# EAGLE design XBee_Explorer (EAGLE 9.6.2)
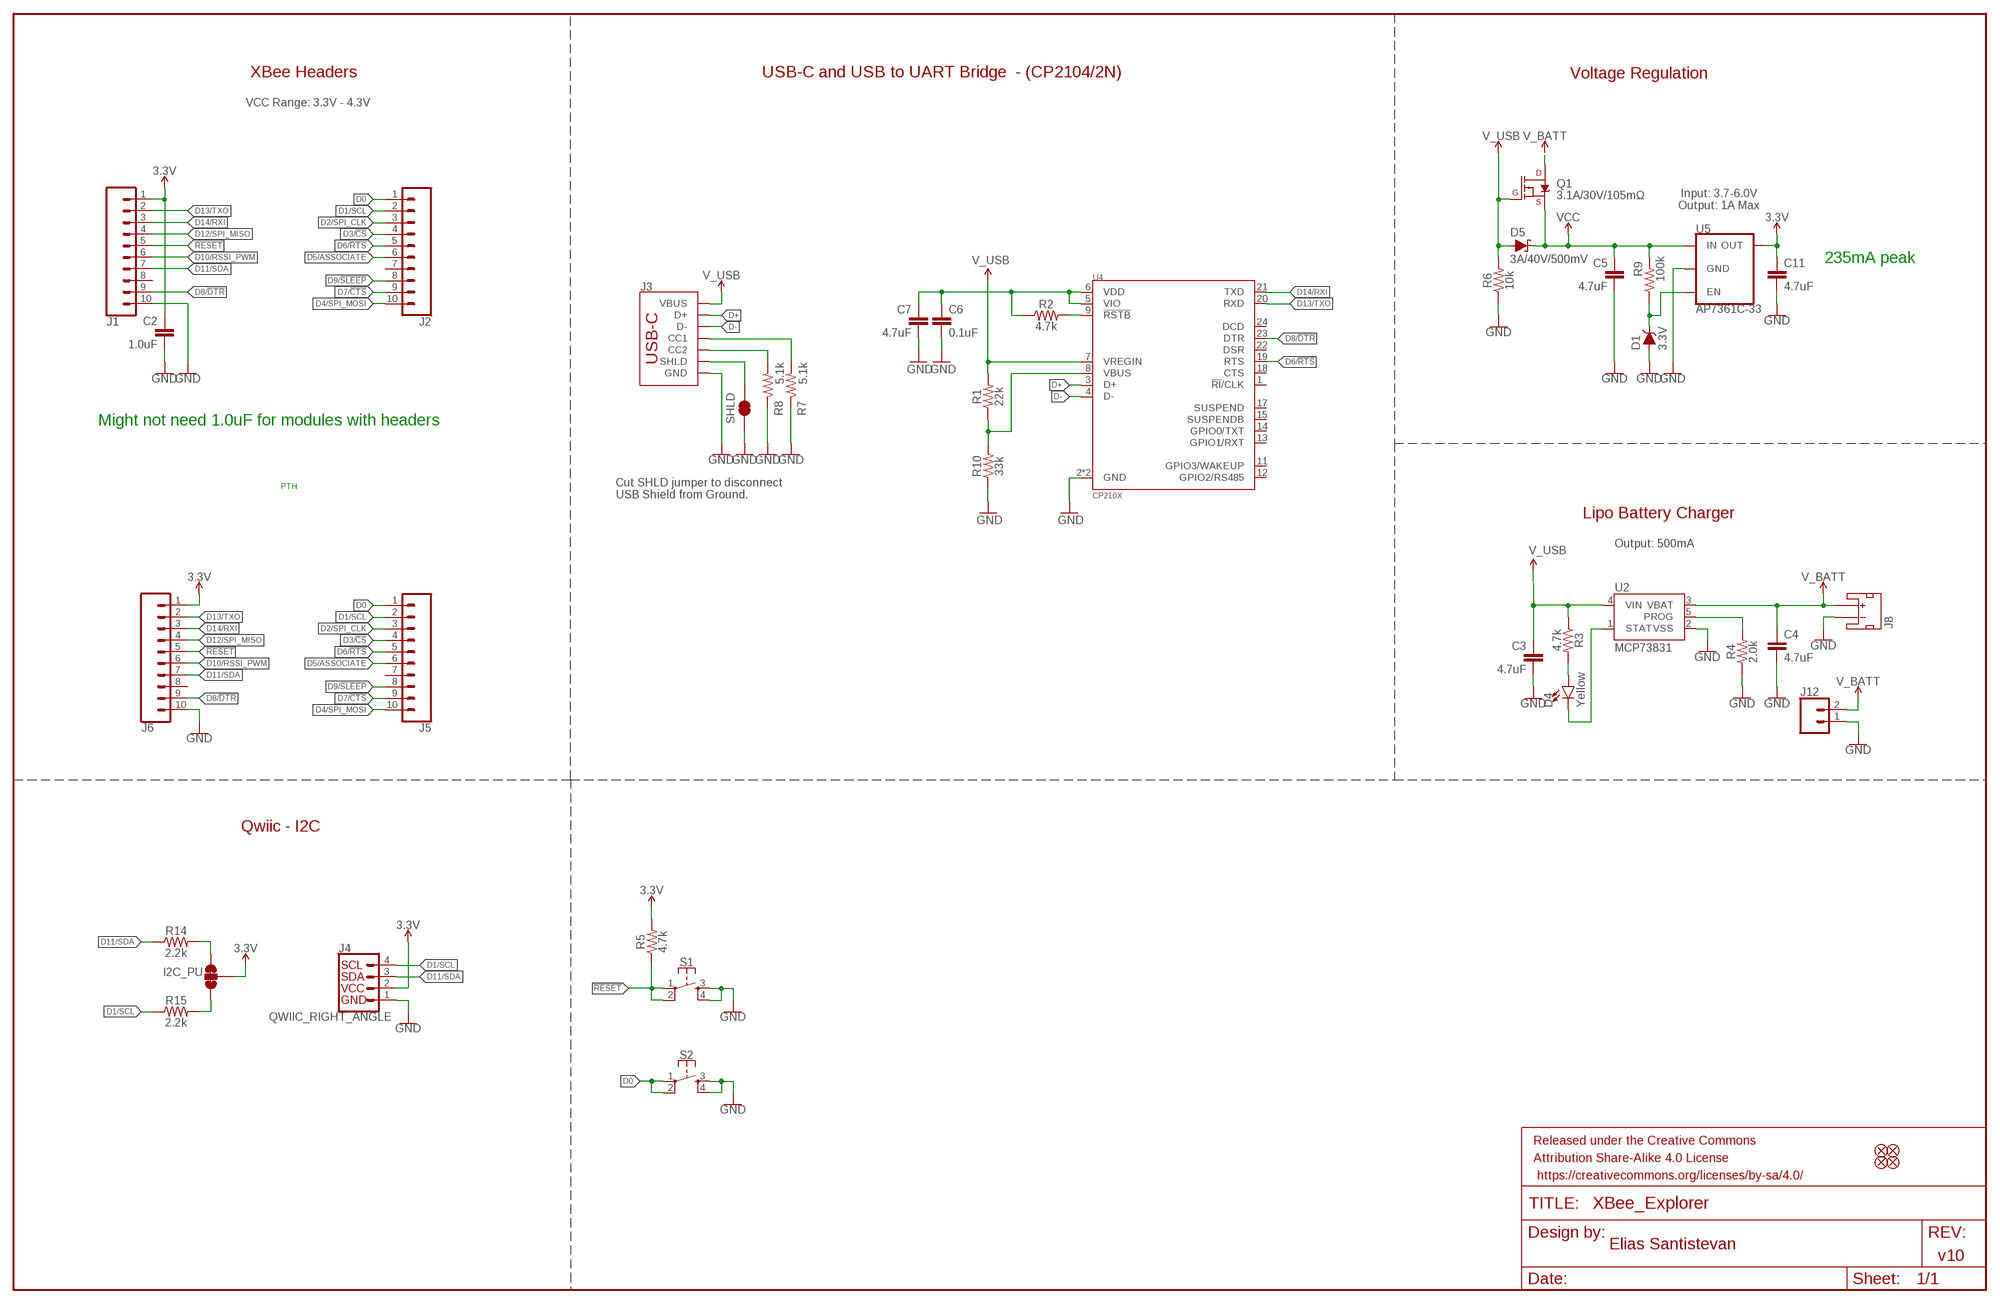
[diagram p0: schematic, sheet 1]

## Parts
C2  1.0uF  1.0UF-0603-16V-10%  [0603]
C3  4.7uF  4.7UF-0603-6.3V-(10%)  [0603]
C4  4.7uF  4.7UF-0603-35V-(20%)  [0603]
C5  4.7uF  4.7UF-0603-6.3V-(10%)  [0603]
C6  0.1uF  0.1UF-0603-25V-(+80/-20%)  [0603]
C7  4.7uF  4.7UF-0603-6.3V-(10%)  [0603]
C11  4.7uF  4.7UF-0603-6.3V-(10%)  [0603]
D1  3.3V  DIODE-ZENER-MM3Z3V3T1G  [SOD-323]
D4  Yellow  LED-YELLOW0603  [LED-0603]
D5  3A/40V/500mV  DIODE-SCHOTTKY-B340A  [SMA-DIODE]
FD1  FIDUCIAL1X2  [FIDUCIAL-1X2]
FD2  FIDUCIAL1X2  [FIDUCIAL-1X2]
FD3  FIDUCIAL1X2  [FIDUCIAL-1X2]
FD4  FIDUCIAL1X2  [FIDUCIAL-1X2]
FRAME1  FRAME-LEDGER  [CREATIVE_COMMONS]
I2C_PU  JUMPER-SMT_3_2-NC_TRACE_SILK  [SMT-JUMPER_3_2-NC_TRACE_SILK]
J1  CONN_10NO_SILK_PTH_FEMALE  [1X10_NO_SILK]
J2  CONN_10NO_SILK_PTH_FEMALE  [1X10_NO_SILK]
J3  USB_C_2-LAYER_PADS  [USB-C-16P-2LAYER-PADS]
J4  QWIIC_RIGHT_ANGLE  QWIIC_CONNECTORJS-1MM  [JST04_1MM_RA]
J5  CONN_10NO_SILK_PTH_FEMALE  [1X10_NO_SILK]
J6  CONN_10NO_SILK_PTH_FEMALE  [1X10_NO_SILK]
J8  JST_2MM_MALE  [JST-2-SMD]
J12  CONN_021X02_NO_SILK  [1X02_NO_SILK]
Q1  3.1A/30V/105mΩ  MOSFET_PCH-DMG2307L  [SOT23-3]
R1  22k  22KOHM-0603-1/10W-1%  [0603]
R2  4.7k  4.7KOHM-0603-1/10W-1%  [0603]
R3  4.7k  4.7KOHM-0603-1/10W-1%  [0603]
R4  2.0k  2.0KOHM-0603-1/10W-5%  [0603]
R5  4.7k  4.7KOHM-0603-1/10W-1%  [0603]
R6  10k  10KOHM-0603-1/10W-1%  [0603]
R7  5.1k  5.1KOHM5.1KOHM-0603-1/10W-1%  [0603]
R8  5.1k  5.1KOHM5.1KOHM-0603-1/10W-1%  [0603]
R9  100k  100KOHM-0603-1/10W-1%  [0603]
R10  33k  33KOHM-0603-1/10W-1%  [0603]
R14  2.2k  2.2KOHM-0603-1/10W-1%  [0603]
R15  2.2k  2.2KOHM-0603-1/10W-1%  [0603]
S1  MOMENTARY-SWITCH-SPST-2-SMD-5.2MM-TALL  [TACTILE_SWITCH_SMD_5.2MM]
S2  MOMENTARY-SWITCH-SPST-2-SMD-5.2MM-TALL  [TACTILE_SWITCH_SMD_5.2MM]
SHLD  JUMPER-SMT_2_NC_TRACE_SILK  [SMT-JUMPER_2_NC_TRACE_SILK]
U2  MCP73831  [SOT23-5]
U4  CP210X  CP2102N  [QFN24]
U5  AP7361C-33  AP7361C-33FGEUDFN-8  [UDFN-8]

## Nets
3.3V: C2.1 C11.1 I2C_PU.2 J1.1 J4.2 J6.1 R5.2 U5.1(OUT)
3.3V_EN_VE: D1.C R9.1 U5.5(EN)
!RESET!: J1.5 J6.5 R5.1 S1.1 S1.2
D0: J2.1 J5.1 S2.1 S2.2
D1/SCL: J2.2 J4.4 J5.2 R15.1
D2/SPI_CLK: J2.3 J5.3
D3/!CS!: J2.4 J5.4
D4/SPI_MOSI: J2.10 J5.10
D5/ASSOCIATE: J2.6 J5.6
D6/!RTS!: J2.5 J5.5 U4.19(RTS)
D7/!CTS!: J2.9 J5.9
D8/!DTR!: J1.9 J6.9 U4.23(DTR)
D9/!SLEEP!: J2.8 J5.8
D10/RSSI_PWM: J1.6 J6.6
D11/SDA: J1.7 J4.3 J6.7 R14.1
D12/SPI_MISO: J1.4 J6.4
D13/TXO: J1.2 J6.2 U4.20(RXD)
D14/RXI: J1.3 J6.3 U4.21(TXD)
D+: J3.A6(D+) J3.B6(D+) U4.3(D+)
D-: J3.A7(D-) J3.B7(D-) U4.4(D-)
GND: C2.2 C3.2 C4.2 C5.2 C6.2 C7.2 C11.2 D1.A J1.10 J3.GND J3.GND2(GND) J4.1 J6.10 J8.1(-) J12.1 R4.1 R6.1 R7.1 R8.1 R10.1 S1.3 S1.4 S2.3 S2.4 SHLD.1 U2.2(VSS) U4.2(GND) U4.PAD(GND) U5.4(GND) U5.EP(GND)
N$1: R4.2 U2.5(PROG)
N$2: R1.1 R10.2 U4.8(VBUS)
N$3: C6.1 C7.1 R2.1 U4.5(VIO) U4.6(VDD)
N$4: J3.B5(CC2) R8.2
N$5: J3.A5(CC1) R7.2
N$6: R2.2 U4.9(!RSTB)
N$8: D4.C U2.1(STAT)
N$9: D4.A R3.2
N$10: C3.1 R3.1 U2.4(VIN)
N$11: I2C_PU.3 R14.2
N$13: I2C_PU.1 R15.2
SHLD: J3.SHLD1(SHLD) J3.SHLD2(SHLD) J3.SHLD3(SHLD) J3.SHLD4(SHLD) SHLD.2
V_BATT [POWER]: C4.1 J8.2(+) J12.2 Q1.3(D) U2.3(VBAT)
V_USB: D5.A J3.VBUS1(VBUS) J3.VBUS2(VBUS) Q1.1(G) R1.2 R6.2 U4.7(VREGIN)
VCC: C5.1 D5.C Q1.2(S) R9.2 U5.8(IN)
Unconnected: J1.8 J2.7 J5.7 J6.8 J8.NC1(PAD1) J8.NC2(PAD2) U4.1(!RI!/CLK) U4.11(GPIO3/WAKEUP) U4.12(GPIO2/RS485) U4.13(GPIO1/RXT) U4.14(GPIO0/TXT) U4.15(SUSPENDB) U4.17(SUSPEND) U4.18(CTS) U4.22(DSR) U4.24(DCD)

## Notes on the sheet
- XBee Headers | USB-C and USB to UART Bridge  - (CP2104/2N) | Voltage Regulation
- VCC Range: 3.3V - 4.3V
- Input: 3.7-6.0V
  Output: 1A Max
- 235mA peak
- Might not need 1.0uF for modules with headers
- PTH
- Cut SHLD jumper to disconnect
  USB Shield from Ground.
- Lipo Battery Charger
- Output: 500mA
- Qwiic - I2C
- Elias Santistevan
- v10

## Library data of the parts
C2 = SparkFun-Capacitors:1.0UF: 1µF ceramic capacitors A capacitor is a passive two-terminal electrical component used to store electrical energy temporarily in an electric field.; PROD_ID: CAP-00868
C3 C5 C7 C11 = SparkFun-Capacitors:4.7UF: 4.7µF ceramic capacitors A capacitor is a passive two-terminal electrical component used to store electrical energy temporarily in an electric field.; PROD_ID: CAP-08280
C4 = SparkFun-Capacitors:4.7UF: 4.7µF ceramic capacitors A capacitor is a passive two-terminal electrical component used to store electrical energy temporarily in an electric field.; PROD_ID: CAP-14106
C6 = SparkFun-Capacitors:0.1UF: 0.1µF ceramic capacitors A capacitor is a passive two-terminal electrical component used to store electrical energy temporarily in an electric field.; PROD_ID: CAP-00810
D1 = SparkFun-DiscreteSemi:DIODE-ZENER: Zener Diode A Zener diode allows current to flow from its anode to its cathode like a normal semiconductor diode, but it also permits current to flow in the reverse direction when its "Zener voltage" is reached. - WIkipedia; PROD_ID: DIO-11284
D4 = SparkFun-LED:LED-YELLOW: Yellow SMD LED Used in manufacturing several products at SparkFun. Packages: 0603 - SMD 0603 package[Product Link] <http://www.kingbrightusa.com/product.asp?catalog_name=LED&product_id=APT1608SYCK> 0603 -SMART - SMART SMD 0603 package (more efficient/more expensive) [Product Link] <http://www.osram-os.com/osram_os/en/products/product-catalog/led-light-emitting-diodes/smartled-0603/ly-l29k/index.jsp> LilyPad - SMD1206 package[Product Datasheet] <https://www.sparkfun.com/datasheets/DevTools/LilyPad/Q150YUS4.pdf> SparkFun Products: Blynk Board <https://www.sparkfun.com/products/13794> IOIO-OTG <https://www.sparkfun.com/products/13613> XBee Explorer Serial <https://www.sparkfun.com/products/13225>; PROD_ID: DIO-09003
D5 = SparkFun-DiscreteSemi:DIODE-SCHOTTKY: Schottky diode A Schottky diode is a semiconductor diode which has a low forward voltage drop and a very fast switching action.; PROD_ID: DIO-09886
FD1-FD4 = SparkFun-Aesthetics:FIDUCIAL: Fiducial Alignment Points Point-of-reference for pick-and-place machines and other optical instruments.
FRAME1 = SparkFun-Aesthetics:FRAME-LEDGER: Schematic Frame - Ledger Standard 11x14 US Ledger frame
I2C_PU = SparkFun-Jumpers:JUMPER-SMT_3_2-NC_TRACE: Normally closed trace jumper (2 of 2 connections) This jumper has a trace between all three pads so they are normally closed (NC). Use a razor knife to open the connection(s). For best results follow the IPC guidelines for cutting traces: Cutout at least 0.063 mm (0.005 in). Remove all loose material to clean up the cut area. Seal the cut with an approved epoxy. Reapply solder to reclose the connection(s).
J1 J2 J5 J6 = SparkFun-Connectors:CONN_10: Multi connection point. Often used as Generic Header-pin footprint for 0.1 inch spaced/style header connections On any of the 0.1 inch spaced packages, you can populate with these: Break Away Headers - Straight <https://www.sparkfun.com/products/116> (PRT-00116) Break Away Male Headers - Right Angle <https://www.sparkfun.com/products/553> (PRT-00553) Female Headers <https://www.sparkfun.com/products/115> (PRT-00115) Break Away Headers - Machine Pin <https://www.sparkfun.com/products/117> (PRT-00117) Break Away Female Headers - Swiss Machine Pin <https://www.sparkfun.com/products/743> (PRT-00743) Arduino Stackable Header - 10 Pin <https://www.sparkfun.com/products/11376> (PRT-11376) For SCREWTERMINALS and SPRING TERMINALS visit here: Screw Terimnals on SparkFun.com <https://www.sparkfun.com/search/results?term=Screw+Terminals> (5mm/3.5mm/2.54mm spacing) This device is also useful as a general connection point to wire up your design to another part of your project. Our various solder wires solder well into these plated through hole pads. Hook-Up Wire - Assortment (Stranded, 22 AWG) <https://www.sparkfun.com/products/11375> (PRT-11375) Hook-Up Wire - Assortment (Solid Core, 22 AWG) <https://www.sparkfun.com/products/11367> (PRT-11367) View the entire wire category on our website here <https://www.sparkfun.com/categories/141> Special notes: Molex polarized connector foot print use with SKU : PRT-08231 with associated crimp pins and housings. 1MM SMD Version SKU: PRT-10208 NOTES ON THE VARIANTS LOCK and LOCK_LONGPADS... This footprint was designed to help hold the alignment of a through-hole component (i.e. 6-pin header) while soldering it into place. You may notice that each hole has been shifted either up or down by 0.005 of an inch from it's more standard position (which is a perfectly straight line). This slight alteration caused the pins (the squares in the middle) to touch the edges of the holes. Because they are alternating, it causes a "brace" to hold the component in place. 0.005 has proven to be the perfect amount of "off-center" position when using our standard breakaway headers. Although looks a little odd when you look at the bare footprint, once you have a header in there, the alteration is very hard to notice. Also,if you push a header all the way into place, it is covered up entirely on the bottom side.
J3 = SparkFun-Connectors:USB_C: USB Type C 16Pin Connector Super Speed pins not available on the 16-pin purely SMD connector so this part is best for USB 2.0 implementations. D1 and D2 are tied together enabling D+/- no matter which way the cable is plugged into the connector. The two channel configuration pins (CC1/2) are exposed. These are normally connected to ground via 5.1k resistors but can be reconfigured for high current/high power applications. **4-LAYER BOARD WARNING!!** If designing 4-layer board, make sure to select the variant _4-LAYER-ISOLATED. The linked footprint (USB-C-16-4LAYER-ISOLATED) includes some very necessary cutout polygons in the inner layers (2 and 15). This prevents the PTH mounting shield legs on the USB connector from electrically connecting any other polygons on the inner layers (usually VCC and GND).; PROD_ID: CONN-14122
J4 = SparkFun-Connectors:QWIIC_CONNECTOR: SparkFun I2C Standard Qwiic Connector An SMD 1mm pitch JST connector makes it easy and quick (get it? Qwiic?) to connect I2C devices to each other. The Qwiic system <http://www.sparkfun.com/qwiic> enables fast and solderless connection between popular platforms and various sensors and actuators. We carry 200mm <https://www.sparkfun.com/products/14204>, 100mm <https://www.sparkfun.com/products/14205>, 50mm <https://www.sparkfun.com/products/14206>, and breadboard friendly <https://www.sparkfun.com/products/14207> Qwiic cables. We also offer 10 pcs strips <https://www.sparkfun.com/products/14323> the SMD connectors.; PROD_ID: CONN-13694
J8 = SparkFun-Connectors:JST_2MM_MALE: JST 2MM MALE RA CONNECTOR Two pin, compact surface mount connector. Commonly used as a battery input connection point. We really like the solid locking feeling and high current rating on these small connectors. We use these all the time as battery connectors. Mates to single-cell LiPo batteries. Here is the connector we sell at SparkFun: JST Right Angle Connector - White <https://www.sparkfun.com/products/8612> (PRT-08612) Datasheet <http://www.sparkfun.com/datasheets/Prototyping/Connectors/JST-Horizontal.pdf> It was used on these SparkFun products: SparkFun MOSFET Power Controller <https://www.sparkfun.com/products/11214> (PRT-11214) SparkFun Battery Babysitter - LiPo Battery Manager <https://www.sparkfun.com/products/13777> (PRT-13777) And many, many others that required a lipo battery connection.; PROD_ID: CONN-11443; SF_ID: PRT-08612
J12 = SparkFun-Connectors:CONN_02: Multi connection point. Often used as Generic Header-pin footprint for 0.1 inch spaced/style header connections On any of the 0.1 inch spaced packages, you can populate with these: Break Away Headers - Straight <https://www.sparkfun.com/products/116> (PRT-00116) Break Away Male Headers - Right Angle <https://www.sparkfun.com/products/553> (PRT-00553) Female Headers <https://www.sparkfun.com/products/115> (PRT-00115) Break Away Headers - Machine Pin <https://www.sparkfun.com/products/117> (PRT-00117) Break Away Female Headers - Swiss Machine Pin <https://www.sparkfun.com/products/743> (PRT-00743) For SCREWTERMINALS and SPRING TERMINALS visit here: Screw Terimnals on SparkFun.com <https://www.sparkfun.com/search/results?term=Screw+Terminals> (5mm/3.5mm/2.54mm spacing) This device is also useful as a general connection point to wire up your design to another part of your project. Our various solder wires solder well into these plated through hole pads. Hook-Up Wire - Assortment (Stranded, 22 AWG) <https://www.sparkfun.com/products/11375> (PRT-11375) Hook-Up Wire - Assortment (Solid Core, 22 AWG) <https://www.sparkfun.com/products/11367> (PRT-11367) View the entire wire category on our website here <https://www.sparkfun.com/categories/141> Special notes: Molex polarized connector foot print use with: PRT-08233 with associated crimp pins and housings. 2.54_SCREWTERM for use with PRT-10571. 3.5mm Screw Terminal footprints for PRT-08084 5mm Screw Terminal footprints for use with PRT-08432
Q1 = SparkFun-DiscreteSemi:MOSFET_PCH: P-channel MOSFETs Voltage controlled devices that allow control of high current outputs. SparkFun Products: SparkFun ESP32 Thing <https://www.sparkfun.com/products/13907> SparkFun ESP8266 Thing <https://www.sparkfun.com/products/13231> SparkFun Pi Servo HAT V2 <https://www.sparkfun.com/products/15316> DMG2305UX-7 (20V/4.2A/SOT23-3); PROD_ID: TRANS-11308
R1 = SparkFun-Resistors:22KOHM: 22kΩ resistor A resistor is a passive two-terminal electrical component that implements electrical resistance as a circuit element. Resistors act to reduce current flow, and, at the same time, act to lower voltage levels within circuits. - Wikipedia; PROD_ID: RES-07853
R2 R3 R5 = SparkFun-Resistors:4.7KOHM: 4.7kΩ resistor A resistor is a passive two-terminal electrical component that implements electrical resistance as a circuit element. Resistors act to reduce current flow, and, at the same time, act to lower voltage levels within circuits. - Wikipedia; PROD_ID: RES-07857
R4 = SparkFun-Resistors:2.0KOHM: 2kΩ resistor A resistor is a passive two-terminal electrical component that implements electrical resistance as a circuit element. Resistors act to reduce current flow, and, at the same time, act to lower voltage levels within circuits. - Wikipedia; PROD_ID: RES-08296
R6 = SparkFun-Resistors:10KOHM: 10kΩ resistor A resistor is a passive two-terminal electrical component that implements electrical resistance as a circuit element. Resistors act to reduce current flow, and, at the same time, act to lower voltage levels within circuits. - Wikipedia; PROD_ID: RES-00824
R7 R8 = SparkFun-Resistors:5.1KOHM; PROD_ID: RES-12083
R9 = SparkFun-Resistors:100KOHM: 100kΩ resistor A resistor is a passive two-terminal electrical component that implements electrical resistance as a circuit element. Resistors act to reduce current flow, and, at the same time, act to lower voltage levels within circuits. - Wikipedia; PROD_ID: RES-07828
R10 = SparkFun-Resistors:33KOHM: 33kΩ resistor A resistor is a passive two-terminal electrical component that implements electrical resistance as a circuit element. Resistors act to reduce current flow, and, at the same time, act to lower voltage levels within circuits. - Wikipedia; PROD_ID: RES-08416
R14 R15 = SparkFun-Resistors:2.2KOHM: 2.2kΩ resistor A resistor is a passive two-terminal electrical component that implements electrical resistance as a circuit element. Resistors act to reduce current flow, and, at the same time, act to lower voltage levels within circuits. - Wikipedia; PROD_ID: RES-08272
S1 S2 = SparkFun-Switches:MOMENTARY-SWITCH-SPST-2: Momentary Switch (Pushbutton) - SPST - Two Circuits Normally-open (NO) SPST momentary switches (buttons, pushbuttons). Schematic symbol includes two switch circuits. Variants SMD-4.6MMX2.8MM - 4.60mm x 2.80mm Tactile Momentary Button Switch - Used on SparkFun Pro Micro - RP2040 <https://www.sparkfun.com/products/17717> SMD-5.2MM - Mini Pushbutton Switch - SMD <https://www.sparkfun.com/products/8720> - Used on Arduino Pro Mini <https://www.sparkfun.com/products/11114>; PROD_ID: SWCH-14139
SHLD = SparkFun-Jumpers:JUMPER-SMT_2_NC_TRACE: Normally closed trace jumper This jumper has a trace between two pads so it's normally closed (NC). Use a razor knife to open the connection. For best results follow the IPC guidelines for cutting traces: Cutout at least 0.063 mm (0.005 in). Remove all loose material to clean up the cut area. Seal the cut with an approved epoxy. Reapply solder to reclose the connection.
U2 = SparkFun-IC-Power:MCP73831: MCP73831T Li-Ion, Li-Pol Controller Miniature single cell, fully integrated Li-Ion, Li-polymer charge management controller Datasheet <http://ww1.microchip.com/downloads/en/DeviceDoc/20001984g.pdf> SparkFun Products: SparkFun ESP32 Thing <https://www.sparkfun.com/products/13907> SparkFun 9DoF Razor IMU M0 <https://www.sparkfun.com/products/14001>; PROD_ID: IC-09995
U4 = SparkFun-IC-Comms:CP2102N; PROD_ID: IC-14020
U5 = SparkFun-IC-Power:AP7361C-33FGE: AP7361C 3.3V LDO Regulator; PROD_ID: VREG-14094

## Net classes
1 POWER: width 0.559 mm, drill 0.305 mm
2 Diff pairs: width 0.203 mm, drill 0.305 mm

## Board
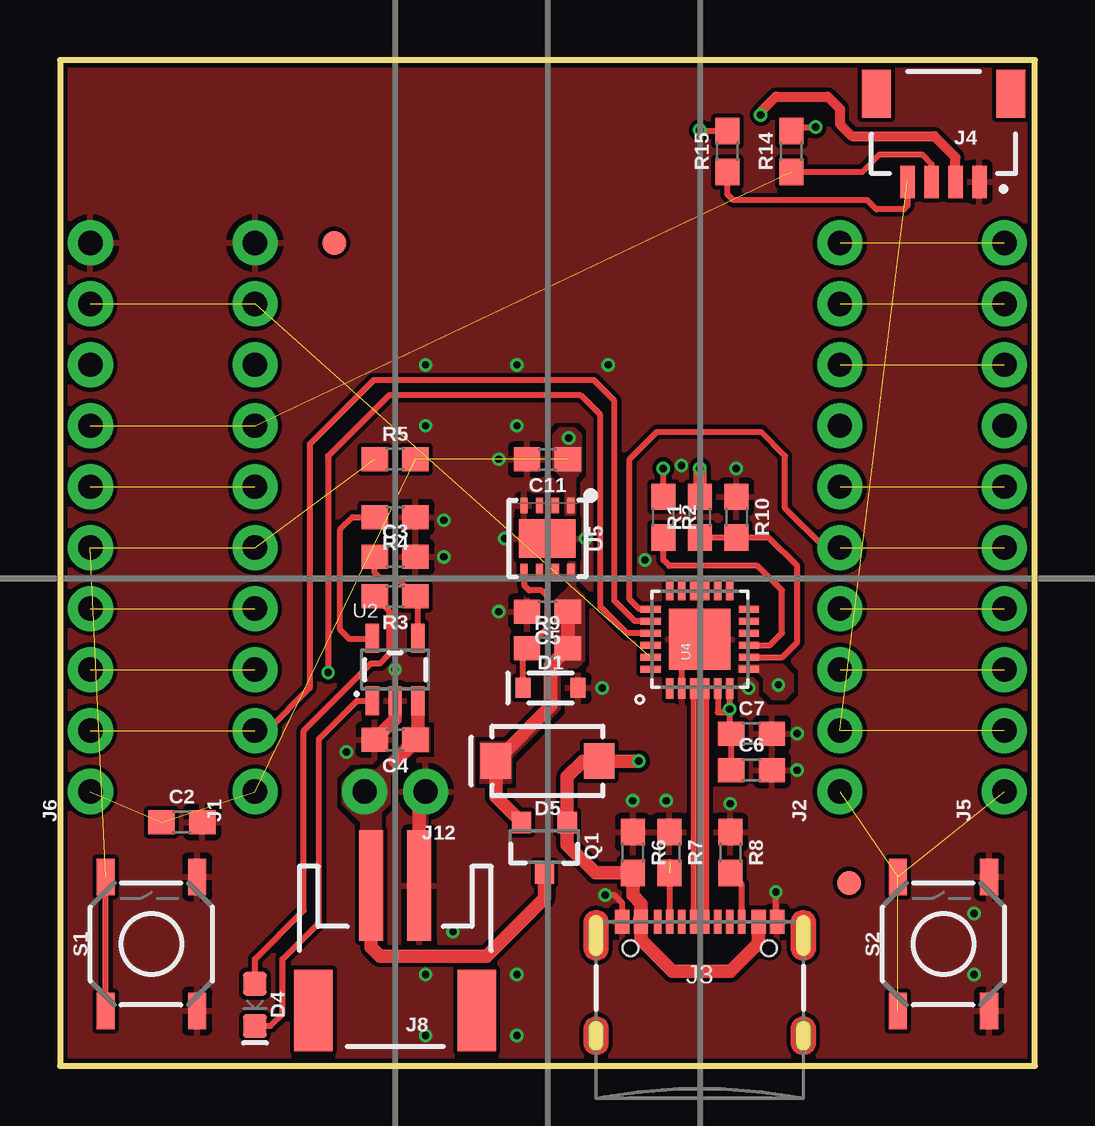
[diagram p1: board, top side]
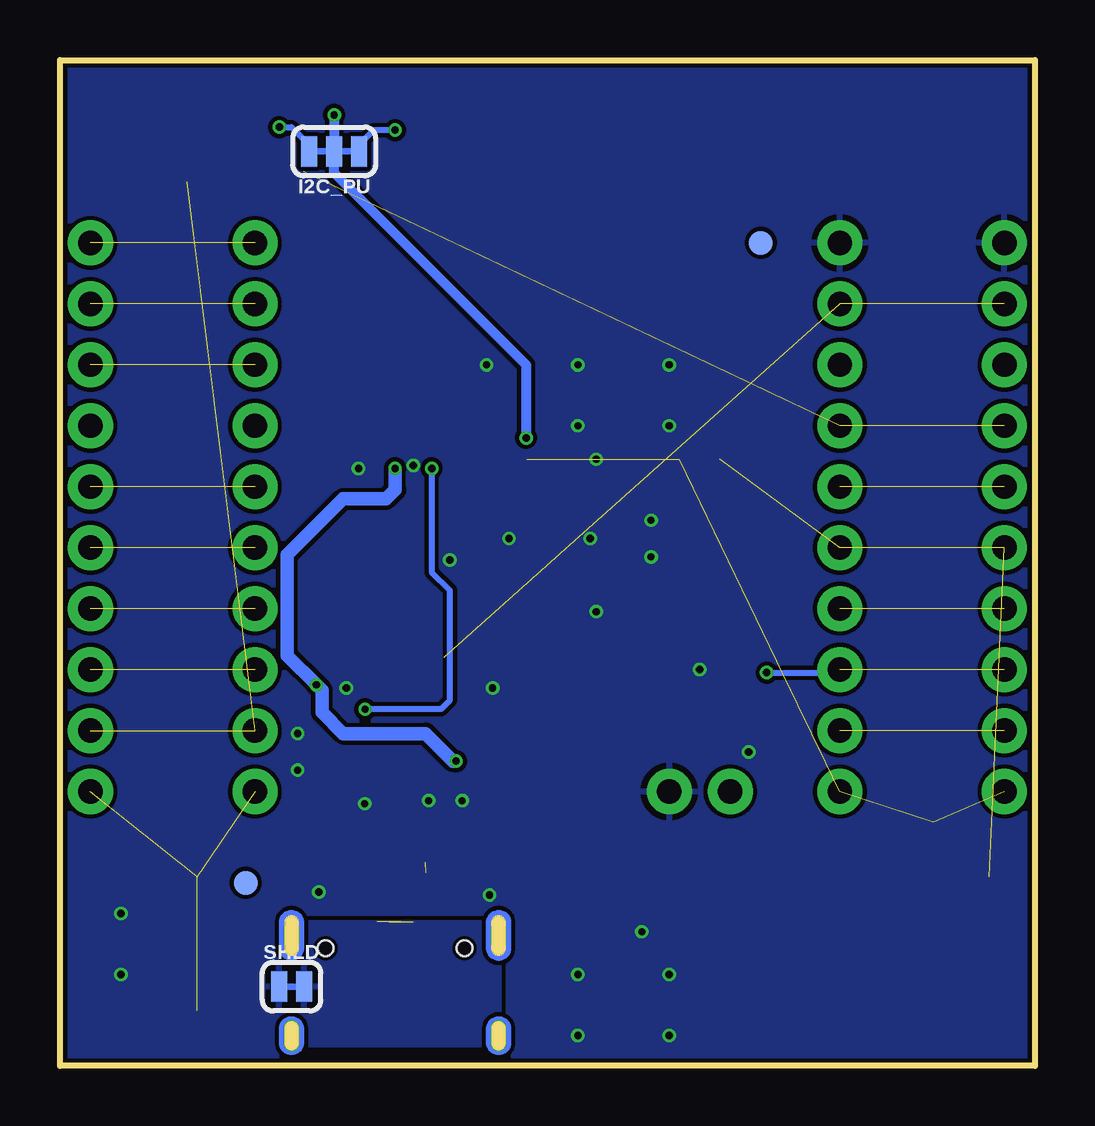
[diagram p2: board, bottom side, seen from below]

Size 40.64 x 41.91 mm. Coordinates in mm from the lower left corner, seen from the top.
Outline: 0,41.91 0,0 40.64,0 40.64,41.91 0,41.91
Copper layers (1*16): Top 0.035mm / dielectric 1.5mm / Bottom 0.035mm
Design rules "SparkFun-2-Layer-Minimum-JLCPCB": minimum track width 5mil, minimum drill 0.3mm, track to track 5mil, track to pad 5mil, pad to pad 5mil, via to via 5mil, smd to smd 5mil, copper to edge 7mil, drill to drill 7mil, minimum pad ring 5mil, minimum via ring 5mil, stop-mask expansion 2.5mil, vias tented up to drill 25mil, thermal gap 10mil

### Footprints (pad centres in the part's own frame; a part is rotated, then mirrored left to right if it is on the bottom)
0603 = smd 1.1 x 1: 1 -0.85,0; 2 0.85,0
SOD-323 = smd 0.63 x 0.83: A 1.15,0; C -1.15,0
LED-0603 = smd 1 x 1: A -0.877,0; C 0.877,0
SMA-DIODE = smd 1.27 x 1.47: A -2.15,0; C 2.15,0
FIDUCIAL-1X2 = smd 1 x 1: 1 0,0
SMT-JUMPER_3_2-NC_TRACE_SILK = smd 0.66 x 1.27: 1 -1.041,0; 2 0,0; 3 1.041,0
1X10_NO_SILK = drill 1.016 pad 1.88: 1 0,0; 2 2.54,0; 3 5.08,0; 4 7.62,0; 5 10.16,0; 6 12.7,0; 7 15.24,0; 8 17.78,0; 9 20.32,0; 10 22.86,0
USB-C-16P-2LAYER-PADS = smd 0.3 x 1: A5 -1.25,-0.34; A6 -0.25,-0.34; A7 0.25,-0.34; A8 1.25,-0.34; B5 1.75,-0.34; B6 0.75,-0.34; B7 -0.75,-0.34; B8 -1.75,-0.34 | smd 0.6 x 1: GND -3.225,-0.34; GND2 3.225,-0.34; VBUS1 -2.45,-0.34; VBUS2 2.45,-0.34 | drill 0.4 pad 0.6 long: SHLD1 -4.318,-0.915; SHLD2 4.318,-0.915; SHLD3 -4.318,-5.095; SHLD4 4.318,-5.095 | hole 0.65: -2.89,-1.445; 2.89,-1.445
JST04_1MM_RA = smd 0.6 x 1.35: 1 -1.5,0; 2 -0.5,0; 3 0.5,0; 4 1.5,0 | smd 1.2 x 2: NC1 2.8,-3.675; NC2 -2.8,-3.675
JST-2-SMD = smd 1 x 4.6: 1 -1,-3.7; 2 1,-3.7 | smd 1.6 x 3.4: NC1 -3.4,1.5; NC2 3.4,1.5
1X02_NO_SILK = drill 1.016 pad 1.88: 1 0,0; 2 2.54,0
SOT23-3 = smd 0.8 x 0.9: 1 -0.95,-1; 2 0.95,-1; 3 0,1.1
TACTILE_SWITCH_SMD_5.2MM = smd 1.524 x 0.762: 1 -2.794,1.905; 2 2.794,1.905; 3 -2.794,-1.905; 4 2.794,-1.905
SMT-JUMPER_2_NC_TRACE_SILK = smd 0.66 x 1.27: 1 -0.521,0; 2 0.521,0
SOT23-5 = smd 0.55 x 1.2: 1 -0.95,-1.3; 2 0,-1.3; 3 0.95,-1.3; 4 0.95,1.3; 5 -0.95,1.3
QFN24 = smd 0.85 x 0.3: 1 -2.05,1.25; 2 -2.05,0.75; 3 -2.05,0.25; 4 -2.05,-0.25; 5 -2.05,-0.75; 6 -2.05,-1.25; 13 2.05,-1.25; 14 2.05,-0.75; 15 2.05,-0.25; 16 2.05,0.25; 17 2.05,0.75; 18 2.05,1.25 | smd 0.3 x 0.85: 7 -1.25,-2.05; 8 -0.75,-2.05; 9 -0.25,-2.05; 10 0.25,-2.05; 11 0.75,-2.05; 12 1.25,-2.05; 19 1.25,2.05; 20 0.75,2.05; 21 0.25,2.05; 22 -0.25,2.05; 23 -0.75,2.05; 24 -1.25,2.05 | smd 2.55 x 2.55: PAD 0,0
UDFN-8 = smd 0.3 x 0.65: 1 -0.975,-1.375; 2 -0.325,-1.375; 3 0.325,-1.375; 4 0.975,-1.375; 5 0.975,1.375; 6 0.325,1.375; 7 -0.325,1.375; 8 -0.975,1.375 | smd 2.35 x 1.6: EP 0,0

### Placement (x,y rotation side)
C2  5.08,10.16 0 top
C3  13.97,21.21 0 top
C4  13.97,13.59 180 top
C5  20.32,18.92 180 top
C6  28.83,12.32 0 top
C7  28.83,13.84 0 top
C11  20.32,25.27 180 top
D1  20.45,15.75 0 top
D4  8.13,2.54 270 top
D5  20.32,12.7 180 top
FD1  11.43,34.29 0 top
FD2  11.43,34.29 0 bottom
FD3  32.89,7.62 0 top
FD4  32.89,7.62 0 bottom
FRAME1  -6.35,-13.97 0 top  (outside the outline)
I2C_PU  29.21,38.1 180 bottom
J1  8.13,11.43 90 top
J2  32.51,11.43 90 top
J3  26.67,6.35 0 top
J4  36.83,36.83 180 top
J5  39.37,11.43 90 top
J6  1.27,11.43 90 top
J8  13.97,3.81 180 top
J12  15.24,11.43 180 top
Q1  20.19,9.14 180 top
R1  26.67,22.86 90 top
R2  25.15,22.86 270 top
R3  13.97,19.56 180 top
R4  13.97,22.86 180 top
R5  13.97,25.27 0 top
R6  23.88,8.89 270 top
R7  25.4,8.89 270 top
R8  27.94,8.89 270 top
R9  20.32,17.4 0 top
R10  28.19,22.86 270 top
R14  30.48,38.1 90 top
R15  27.81,38.1 90 top
S1  3.81,5.08 90 top
S2  36.83,5.08 90 top
SHLD  30.99,3.3 0 bottom
U2  13.97,16.51 0 top
U4  26.67,17.78 90 top
U5  20.32,21.97 180 top

### Tracks (layer width: path | path; a pad name or v marks a point on that pad's centre or on a via)
3.3V  (via drill 0.3)  (4 unrouted)
  Top 0.406: J4.2 37.33,37.85 36.45,38.73 33.02,38.73 32.51,39.24 32.51,39.88 32,40.39 29.84,40.39 29.21,39.75 v29.21,39.62
  Bottom 0.406: v29.21,39.62 I2C_PU.2 29.21,37.21 21.21,29.21 v21.21,26.16
  pour Top (no thermals): 21.08,22.99 21.46,22.99 21.46,24.51 21.72,24.77 21.72,26.29 21.46,26.54 20.83,26.54 20.57,26.29 20.57,24.89 21.08,24.38
3.3V_EN_VE
  Top 0.254: D1.C 19.3,17.23 | R9.1 20.32,18.25 20.32,19.56 20.07,19.81 19.56,19.81 19.34,20.02 U5.5
  Top 0.559: 19.3,17.23 R9.1
!RESET!  (3 unrouted)
  Top 0.254: S1.1 S1.2
D0  (3 unrouted)
D1/SCL  (2 unrouted)
  Top 0.254: J4.4 35.33,35.84 35.18,35.69 34.04,35.69 33.66,36.07 28.07,36.07 27.81,36.32 R15.1
D2/SPI_CLK  (1 unrouted)
D3/!CS!  (1 unrouted)
D4/SPI_MOSI  (1 unrouted)
D5/ASSOCIATE  (1 unrouted)
D6/!RTS!  (1 unrouted)
  Top 0.254: U4.19 24.15,19.03 23.75,19.43 23.75,25.27 24.89,26.42 29.21,26.42 30.23,25.4 30.23,23.24 31.88,21.59 J2.5
D7/!CTS!  (1 unrouted)
D8/!DTR!  (2 unrouted)
D9/!SLEEP!  (1 unrouted)
D10/RSSI_PWM  (1 unrouted)
D11/SDA  (2 unrouted)
  Top 0.254: 36.24,36.74 J4.3 36.33,37.58 35.94,37.97 34.16,37.97 33.44,37.25 R14.1
D12/SPI_MISO  (1 unrouted)
D13/TXO  (1 unrouted)
  Top 0.254: U4.20 23.96,18.53 23.11,19.38 23.11,27.71 22.25,28.57 13.08,28.57 10.41,25.91 10.41,15.75 8.64,13.97 J1.2
D14/RXI  (via drill 0.3)  (1 unrouted)
  Top 0.254: U4.21 23.63,18.03 22.53,19.13 22.53,27.13 21.72,27.94 13.72,27.94 11.18,25.4 v11.18,16.38
  Bottom 0.254: v11.18,16.38 8.26,16.38 J1.3
D+  (1 unrouted)
  Top 0.254: J3.A6 U4.3
D-  (1 unrouted)
  Top 0.254: U4.4 J3.A7
GND  (via drill 0.3)
  Top 0.254: U4.2 25.92,17.03 U4.PAD | J3.GND 23.45,6.78 23.11,7.11 v22.73,7.11 | J3.GND2 29.84,6.06 v29.84,7.24
  Top 0.559: C4.2 13.97,14.44 U2.2 | J8.1 14.97,11.16 J12.1
  other vias: 18.54,21.97 21.92,21.97 28.19,24.89 30.73,13.84 30.73,12.32 27.94,10.92 25.27,11.05 23.88,11.05 22.61,15.75 18.29,18.92 18.29,25.27 16,22.73 16,21.21 11.94,13.08 25.91,25.02 19.05,29.21 22.86,29.21 24.38,21.08 13.97,16.51 15.24,26.67 19.05,26.67 15.24,29.21 16.38,5.59 15.24,3.81 19.05,3.81 15.24,1.27 19.05,1.27 38.1,6.35 38.1,3.81 28.7,15.75
  pour Top (isolate 0.178, rank 3): 0,0 40.64,0 40.64,41.91 0,41.91
  pour Bottom (isolate 0.178, rank 3): 0,0 40.64,0 40.64,41.91 0,41.91
N$1
  Top 0.254: U2.5 12.99,17.78 12.06,17.78 11.68,18.16 11.68,22.35 12.19,22.86 R4.2
N$2
  Top 0.254: R1.1 R10.2 29.55,22.01 30.73,20.83 30.73,17.65 30.11,17.03 U4.8
N$3  (via drill 0.3)
  Top 0.254: 27.92,14.73 27.92,13.9 C7.1 C6.1 | 27.92,14.73 v27.92,14.86 U4.6 | U4.5 27.42,14.73 27.92,14.73 | R2.1 v25.15,24.89
  Bottom 0.254: v25.15,24.89 25.15,20.57 24.38,19.81 24.38,15.24 24.77,14.86 v27.92,14.86
N$4
  Top 0.254: J3.B5 28.42,7.56 R8.2
N$5  (1 unrouted)
  Top 0.254: J3.A5 25.42,6.35 25.42,8.49
N$6
  Top 0.254: R2.2 25.15,21.08 25.4,20.83 29.08,20.83 30.1,19.81 30.1,18.03 29.59,17.53 U4.9
N$8
  Top 0.254: 13.02,15.59 U2.1 12.38,15.21 10.79,13.62 10.79,5.97 9.27,4.45 9.27,2.16 8.78,1.66 D4.C 8.65,1.66
N$9
  Top 0.254: R3.2 13.72,18.96 13.72,17.14 13.34,16.76 12.95,16.76 10.16,13.97 10.16,6.48 8.13,4.45 D4.A
N$10
  Top 0.254: U2.4 14.92,19.46 R3.1 14.06,20.32 13.34,20.32 13.12,20.54 C3.1
N$11  (via drill 0.3)
  Top 0.254: R14.2 30.65,39.12 v31.5,39.12
  Bottom 0.254: v31.5,39.12 30.99,39.12 30.25,38.38 I2C_PU.3
N$13  (via drill 0.3)
  Top 0.254: R15.2 26.71,38.95 v26.67,38.99
  Bottom 0.254: v26.67,38.99 27.56,38.99 28.17,38.38 I2C_PU.1
SHLD
  pour Top (isolate 0.178): 22.35,6.1 22.35,0.89 30.99,0.89 30.99,6.1
  pour Bottom (isolate 0.178): 22.35,5.97 22.35,0.89 30.99,0.89 30.99,5.97
V_BATT
  Top 0.559: 13.97,12.7 14.82,13.55 C4.1 14.92,13.69 U2.3 | Q1.3 20.19,6.99 17.78,4.57 13.34,4.57 12.97,4.94 J8.2
  pour Top (no thermals): 12.57,7.62 12.57,10.16 11.81,10.92 11.81,11.81 12.32,12.32 13.21,12.32 14.35,13.46 14.35,14.1 15.37,14.1 15.37,13.08 14.73,13.08 13.72,12.06 13.72,10.92 13.34,10.54 13.34,7.62
V_USB  (via drill 0.3)
  Top 0.559: J3.VBUS1 24.22,5.24 25.53,3.94 27.94,3.94 29.12,5.12 J3.VBUS2 | Q1.1 21.16,10.16 | Q1.1 21.14,9.21 22.31,8.04 R6.2 23.88,7.1 24.22,6.76 J3.VBUS1 | Q1.1 21.14,12.05 21.79,12.7 D5.A v24.13,12.7 | J3.VBUS1 24.15,6.08 | v26.67,24.89 R1.2
  Bottom 0.559: v24.13,12.7 24.26,12.7 25.4,13.84 28.83,13.84 29.72,14.73 29.72,15.65 v29.95,15.88 31.17,17.09 31.17,21.29 28.83,23.62 27.05,23.62 26.67,24 v26.67,24.89
  pour Top (no thermals): 28.3,16.43 29.08,16.43 29.36,16.15 29.36,15.62 29.69,15.29 30.23,15.29 30.56,15.62 30.56,16.28 30.15,16.69 28.3,16.69
VCC
  Top 0.559: 21.3,19.05 C5.1 R9.2 20.45,16.68 20.45,14.98 D5.C 18.17,11.22 18.5,10.88 Q1.2
  pour Top (no thermals): 21.21,20.95 21.21,19.94 20.7,19.43 20.7,17.27 20.19,16.76 20.19,14.99 18.67,13.46 17.53,13.46 17.53,11.81 18.8,11.81 18.8,12.83 20.83,14.86 20.83,16.26 21.21,16.64 21.59,16.64 21.84,16.89 21.84,19.56 21.46,19.94 21.46,20.95

### Text on the board
tDocu: Elias Santistevan